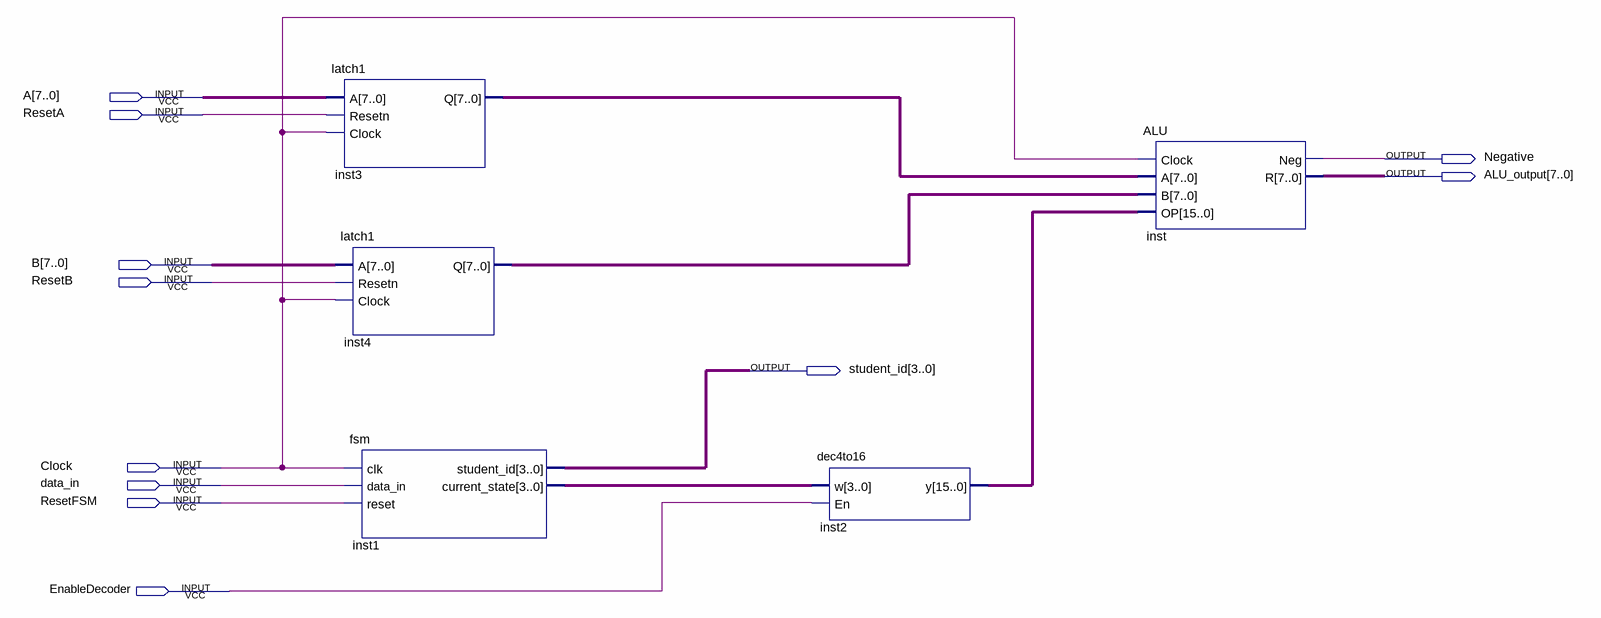
[diagram p0: schematic sheet]
// Quartus schematic finalDesign3.bdf as structural Verilog: 5 symbols, 11 pins
module finalDesign3 (
  input  [7:0] A,
  input  ResetA,
  input  [7:0] B,
  input  ResetB,
  input  Clock,
  input  data_in,
  input  ResetFSM,
  input  EnableDecoder,
  output Negative,
  output [7:0] ALU_output,
  output [3:0] student_id
);

  wire [3:0] inst1_current_state;
  wire [7:0] inst3_q, inst4_q;
  wire [15:0] inst2_y;

  latch1 inst3 (.A(A), .Resetn(ResetA), .Clock(Clock), .Q(inst3_q));
  latch1 inst4 (.A(B), .Resetn(ResetB), .Clock(Clock), .Q(inst4_q));
  fsm inst1 (
    .clk(Clock), .data_in(data_in), .reset(ResetFSM), .student_id(student_id),
    .current_state(inst1_current_state));
  dec4to16 inst2 (.w(inst1_current_state), .En(EnableDecoder), .y(inst2_y));
  ALU inst (.Clock(Clock), .A(inst3_q), .B(inst4_q), .OP(inst2_y), .Neg(Negative), .R(ALU_output));
endmodule
